# EAGLE design KnobController (EAGLE 7.6.0)
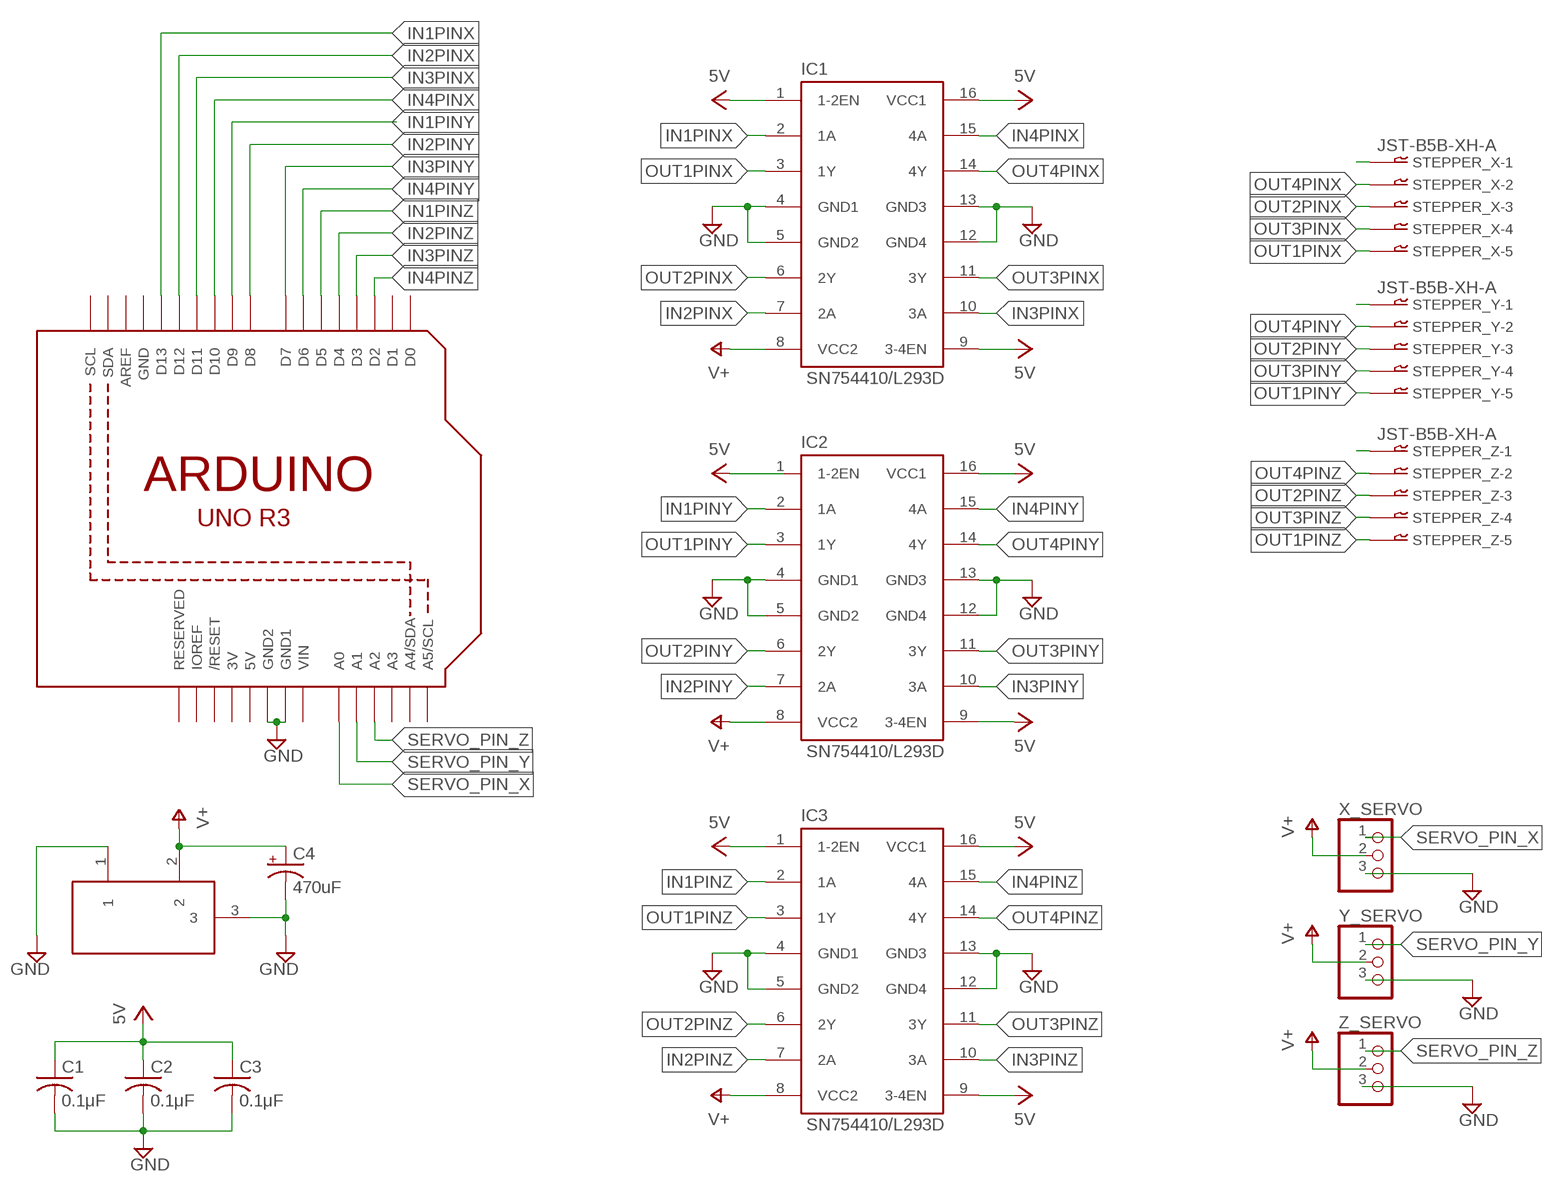
[diagram p0: schematic, sheet 1]

## Parts
C1  0.1μF  C-US025-025X050  [C025-025X050]
C2  0.1μF  C-US025-025X050  [C025-025X050]
C3  0.1μF  C-US025-025X050  [C025-025X050]
C4  470uF  CPOL-USE2.5-7  [E2,5-7]
IC1  SN754410/L293D  L293D  [DIL16]
IC2  SN754410/L293D  L293D  [DIL16]
IC3  SN754410/L293D  L293D  [DIL16]
PWR  MOTOR  DC21MMX  [DC-21MM]
STEPPER_X  JST-B5B-XH-A  05-JST-B5B-XH-A  [B5B-XH]
STEPPER_Y  JST-B5B-XH-A  05-JST-B5B-XH-A  [B5B-XH]
STEPPER_Z  JST-B5B-XH-A  05-JST-B5B-XH-A  [B5B-XH]
U1  ARDUINOR3-BPLACE  [ARDUINOR3-BPLACE]
X_SERVO  PINHD-1X3  [1X03]
Y_SERVO  PINHD-1X3  [1X03]
Z_SERVO  PINHD-1X3  [1X03]

## Nets
5V [5V]: C1.1 C2.1 C3.1 IC1.1(1-2EN) IC1.9(3-4EN) IC1.16(VCC1) IC2.1(1-2EN) IC2.9(3-4EN) IC2.16(VCC1) IC3.1(1-2EN) IC3.9(3-4EN) IC3.16(VCC1)
GND: C1.2 C2.2 C3.2 C4.- IC1.4(GND1) IC1.5(GND2) IC1.12(GND4) IC1.13(GND3) IC2.4(GND1) IC2.5(GND2) IC2.12(GND4) IC2.13(GND3) IC3.4(GND1) IC3.5(GND2) IC3.12(GND4) IC3.13(GND3) PWR.1 PWR.3 U1.GND1 U1.GND2 X_SERVO.3 Y_SERVO.3 Z_SERVO.3
IN1PINX: IC1.2(1A) U1.D13
IN1PINY: IC2.2(1A) U1.D9
IN1PINZ: IC3.2(1A) U1.D5
IN2PINX: IC1.7(2A) U1.D12
IN2PINY: IC2.7(2A) U1.D8
IN2PINZ: IC3.7(2A) U1.D4
IN3PINX: IC1.10(3A) U1.D11
IN3PINY: IC2.10(3A) U1.D7
IN3PINZ: IC3.10(3A) U1.D3
IN4PINX: IC1.15(4A) U1.D10
IN4PINY: IC2.15(4A) U1.D6
IN4PINZ: IC3.15(4A) U1.D2
N$8: STEPPER_Y.P$1
N$13: STEPPER_Z.P$1
NULL: STEPPER_X.P$1
OUT1PINX: IC1.3(1Y) STEPPER_X.P$5
OUT1PINY: IC2.3(1Y) STEPPER_Y.P$5
OUT1PINZ: IC3.3(1Y) STEPPER_Z.P$5
OUT2PINX: IC1.6(2Y) STEPPER_X.P$3
OUT2PINY: IC2.6(2Y) STEPPER_Y.P$3
OUT2PINZ: IC3.6(2Y) STEPPER_Z.P$3
OUT3PINX: IC1.11(3Y) STEPPER_X.P$4
OUT3PINY: IC2.11(3Y) STEPPER_Y.P$4
OUT3PINZ: IC3.11(3Y) STEPPER_Z.P$4
OUT4PINX: IC1.14(4Y) STEPPER_X.P$2
OUT4PINY: IC2.14(4Y) STEPPER_Y.P$2
OUT4PINZ: IC3.14(4Y) STEPPER_Z.P$2
SERVO_PIN_X: U1.A0 X_SERVO.1
SERVO_PIN_Y: U1.A1 Y_SERVO.1
SERVO_PIN_Z: U1.A2 Z_SERVO.1
VCC [VCC]: C4.+ IC1.8(VCC2) IC2.8(VCC2) IC3.8(VCC2) PWR.2 X_SERVO.2 Y_SERVO.2 Z_SERVO.2 ; supply symbol labelled V+
Unconnected: U1.A3 U1.A4(A4/SDA) U1.A5(A5/SCL) U1.AREF U1.D0 U1.D1 U1.IOREF U1.RESERVED U1.RESET(/RESET) U1.SCL U1.SDA

## Power pins joined to a net without a drawn wire
3V: U1.3V
5V: U1.5V
GND: U1.GND
VIN: U1.VIN

## Library data of the parts
C1-C3 = resistor:C-US: CAPACITOR, American symbol
C4 = rcl:CPOL-US: POLARIZED CAPACITOR, American symbol
IC1-IC3 = st-microelectronics:L293D: PUSH-PULL 4 CHANNEL DRIVER; MPN: L293D; OC_FARNELL: 9589619; OC_NEWARK: 56P8249
PWR = powersupply:DC21MM
STEPPER_X STEPPER_Y STEPPER_Z = bt_con-jst-xh:05-JST: JST CONNECTOR
U1 = adafruit:ARDUINOR3: This is a new object for the new Arduino R3 - with extra pins that you may want to use (such as IOref, and duplicated A4/A5
X_SERVO Y_SERVO Z_SERVO = pinhead:PINHD-1X3: PIN HEADER

## Net classes
0 default: width 0.406 mm, clearance 0.305 mm
1 5V: width 0.508 mm, clearance 0.305 mm
2 VCC: width 1.27 mm, clearance 0.305 mm

## Board
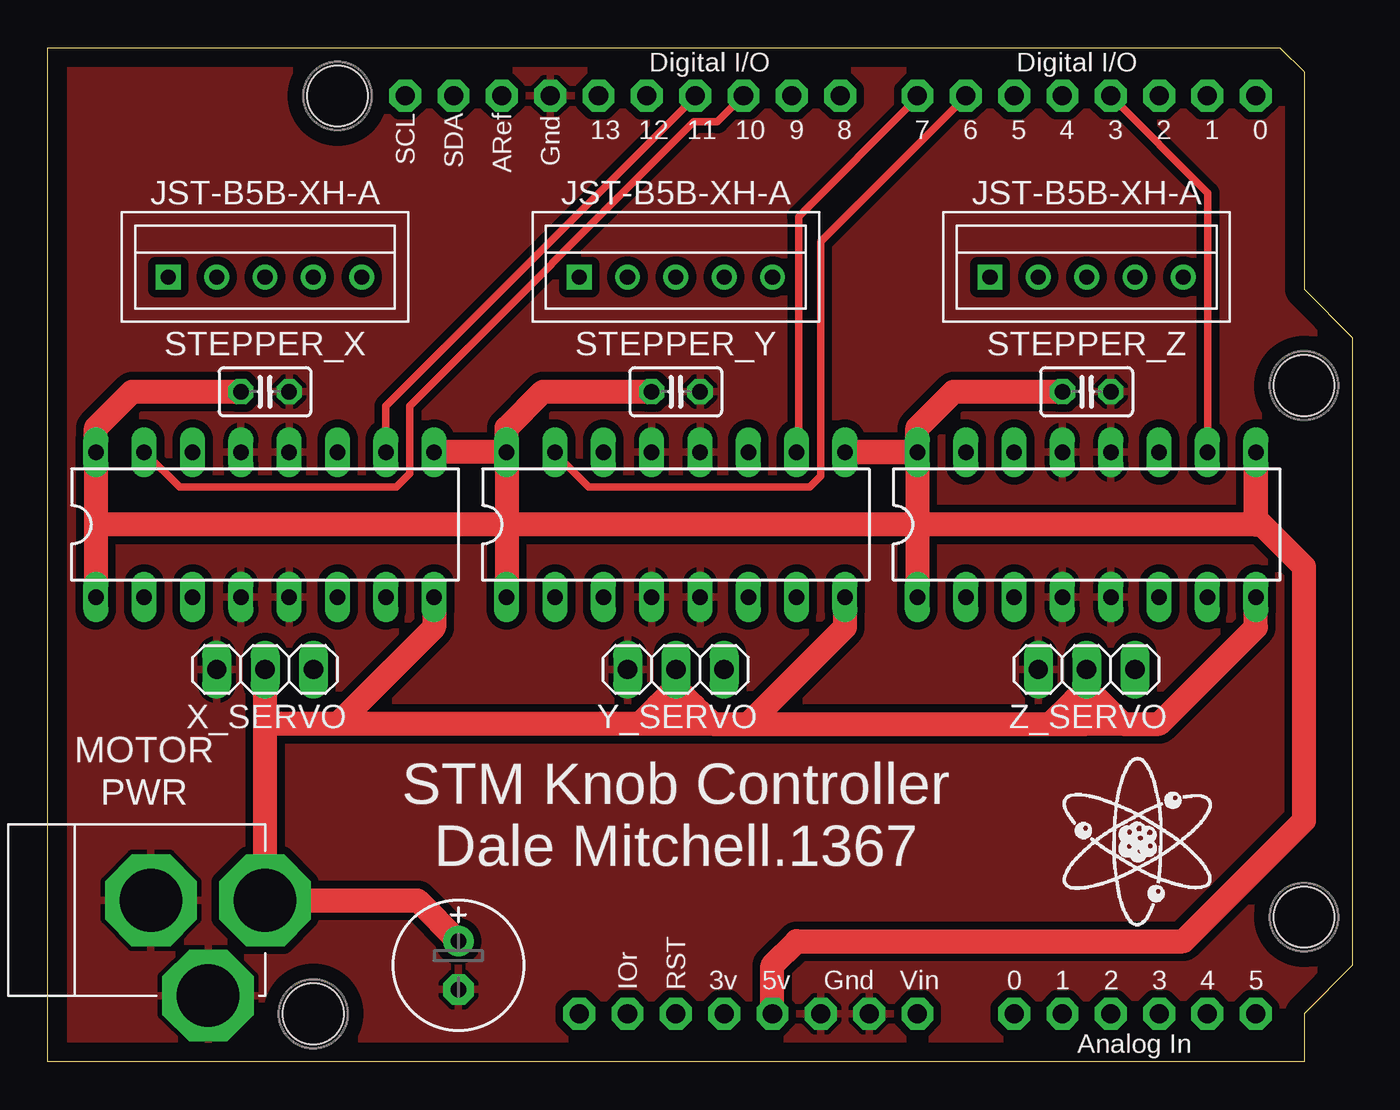
[diagram p1: board, top side]
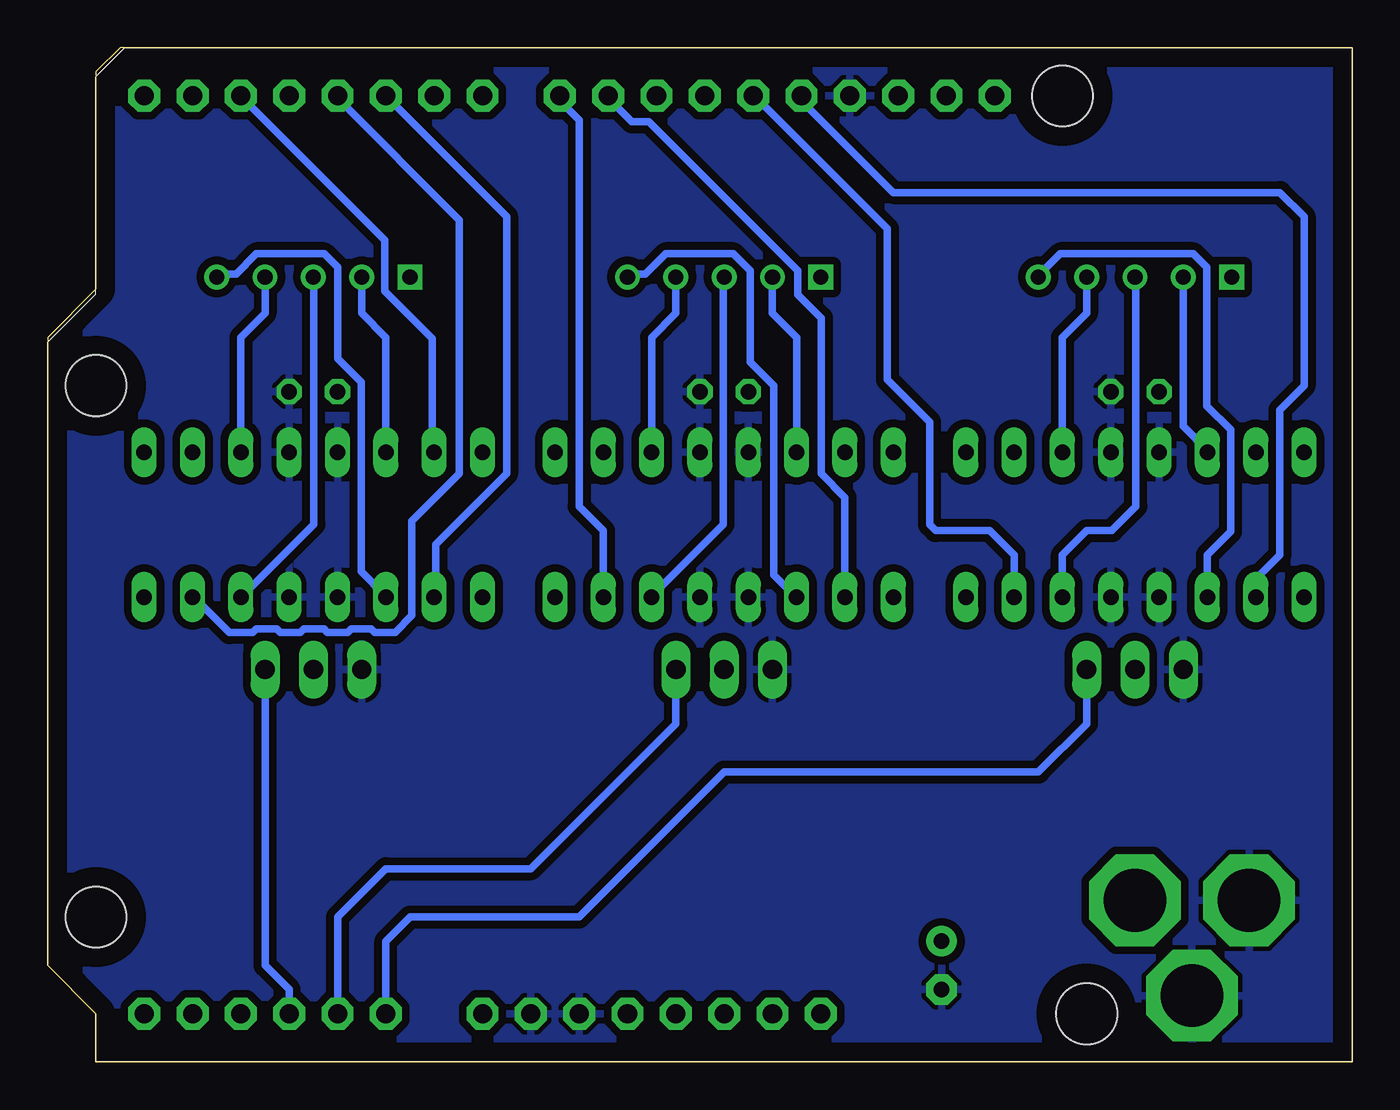
[diagram p2: board, bottom side, seen from below]

Size 68.58 x 53.34 mm. Coordinates in mm from the lower left corner, seen from the top.
Outline: 0,0 0,53.34 64.77,53.34 66.04,52.07 66.04,40.64 68.58,38.1 68.58,5.08 66.04,2.54 66.04,0 0,0
Copper layers (1*16): Top 0.035mm / dielectric 1.5mm / Bottom 0.035mm
Design rules "default *": minimum track width 10mil, minimum drill 24mil, track to track 16mil, track to pad 12mil, pad to pad 9mil, via to via 8mil, smd to smd 8mil, copper to edge 40mil, drill to drill 8mil, minimum pad ring 10mil, minimum via ring 8mil, stop-mask expansion 4mil, vias tented up to drill 0mil, thermal gap 10mil
Holes 3.2 mm at 13.97,2.54 15.24,50.8 66.04,35.56 66.04,7.62

### Footprints (pad centres in the part's own frame; a part is rotated, then mirrored left to right if it is on the bottom)
C025-025X050 = drill 0.813 octagon: 1 -1.27,0; 2 1.27,0
E2,5-7 = drill 0.813 pad 1.6: + -1.27,0 | drill 0.813 pad 1.6 octagon: - 1.27,0
DIL16 = drill 0.813 long: 1 -8.89,-3.81; 2 -6.35,-3.81; 3 -3.81,-3.81; 4 -1.27,-3.81; 5 1.27,-3.81; 6 3.81,-3.81; 7 6.35,-3.81; 8 8.89,-3.81; 9 8.89,3.81; 10 6.35,3.81; 11 3.81,3.81; 12 1.27,3.81; 13 -1.27,3.81; 14 -3.81,3.81; 15 -6.35,3.81; 16 -8.89,3.81
DC-21MM = drill 3.302 pad 4.826 octagon: 1 -5.08,-3.353; 2 -0.076,-6.35; 3 -0.076,-0.356
B5B-XH = drill 0.8 square: P$1 -5.08,0 | drill 0.8: P$2 -2.54,0; P$3 0,0; P$4 2.54,0; P$5 5.08,0
ARDUINOR3-BPLACE = drill 1 pad 1.676 octagon: 3V 35.56,2.54; 5V 38.1,2.54; A0 50.8,2.54; A1 53.34,2.54; A2 55.88,2.54; A3 58.42,2.54; A4 60.96,2.54; A5 63.5,2.54; AREF 23.876,50.8; D0 63.5,50.8; D1 60.96,50.8; D2 58.42,50.8; D3 55.88,50.8; D4 53.34,50.8; D5 50.8,50.8; D6 48.26,50.8; D7 45.72,50.8; D8 41.656,50.8; D9 39.116,50.8; D10 36.576,50.8; D11 34.036,50.8; D12 31.496,50.8; D13 28.956,50.8; GND 26.416,50.8; GND1 43.18,2.54; GND2 40.64,2.54; IOREF 30.48,2.54; RESERVED 27.94,2.54; RESET 33.02,2.54; SCL 18.796,50.8; SDA 21.336,50.8; VIN 45.72,2.54
1X03 = drill 1.016 long: 1 -2.54,0; 2 0,0; 3 2.54,0

### Placement (x,y rotation side)
C1  11.43,35.24 0 top
C2  33.02,35.24 0 top
C3  54.61,35.24 0 top
C4  21.59,5.08 270 top
IC1  11.43,28.26 0 top
IC2  33.02,28.26 0 top
IC3  54.61,28.26 0 top
PWR  5.08,8.57 90 top
STEPPER_X  11.43,41.27 0 top
STEPPER_Y  33.02,41.27 0 top
STEPPER_Z  54.61,41.27 0 top
U1  0,0 0 top
U$1  [ATOM]  57.47,11.43 0 top
X_SERVO  11.43,20.64 180 top
Y_SERVO  33.02,20.64 180 top
Z_SERVO  54.61,20.64 180 top

### Tracks (layer width: path | path; a pad name or v marks a point on that pad's centre or on a via)
5V
  Top 0.508: 24.13,28.27 24.18,28.27 24.18,28.26
  Top 1.27: 2.54,27.94 IC1.16 2.54,33.34 4.45,35.24 C1.1 | 2.54,27.94 IC1.1 | IC2.16 24.13,28.27 IC2.1 | IC3.16 45.72,31.75 | 45.72,28.26 IC3.1 | IC2.16 IC1.9 | IC2.16 24.13,33.34 26.04,35.24 C2.1 | IC3.16 45.72,33.34 47.62,35.24 C3.1 | U1.5V 38.1,5.08 39.37,6.35 59.69,6.35 66.04,12.7 66.04,26.04 63.5,28.57 IC3.9 63.5,28.26 45.72,28.26 | 45.72,28.26 24.18,28.26 2.86,28.26 2.54,27.94 | IC3.16 IC2.9 45.4,32.07 45.72,31.75 | 45.72,31.75 45.72,28.26
GND
  pour Bottom (isolate 0.406): 0,0 0,53.34 64.77,53.34 66.04,52.07 66.04,40.64 68.58,38.1 68.58,5.08 66.04,2.54 66.04,0
  pour Top (isolate 0.406): 0,0 0,53.34 64.77,53.34 66.04,52.07 66.04,40.64 68.58,38.1 68.58,5.08 66.04,2.54 66.04,0
IN1PINX
  Bottom 0.406: U1.D13 28.96,50.55 24.13,45.72 3.81,45.72 2.54,44.45 2.54,35.56 3.81,34.29 3.81,26.67 5.08,25.4 IC1.2
IN1PINY
  Bottom 0.406: IC2.2 26.67,29.69 27.91,30.94 27.91,39.12 29.16,40.36 29.16,41.6 36.98,49.43 37.87,49.43 39.12,50.67 U1.D9
IN1PINZ
  Bottom 0.406: U1.D5 44.45,44.45 44.45,30.94 48.18,27.2 48.18,24.54 IC3.2
IN2PINX
  Bottom 0.406: U1.D12 31.43,50.8 24.45,43.81 24.45,35.88 22.23,33.66 22.23,28.26 21.91,27.94 19.05,27.94 17.78,26.67 IC1.7
IN2PINY
  Bottom 0.406: U1.D8 41.66,50.55 40.64,49.53 40.64,29.21 39.37,27.94 IC2.7
IN2PINZ
  Bottom 0.406: IC3.7 60.81,24.36 59.03,22.58 57.78,22.58 57.61,22.76 56.54,22.76 56.36,22.58 55.3,22.58 55.12,22.76 54.05,22.76 53.87,22.58 52.81,22.58 52.63,22.76 51.56,22.76 51.38,22.58 50.32,22.58 49.43,23.47 49.43,28.45 46.94,30.94 46.94,44.27 53.34,50.67 U1.D4
IN3PINX
  Top 0.406: IC1.10 17.78,34.49 33.96,50.67 U1.D11
IN3PINY
  Top 0.406: IC2.10 39.47,32.18 39.47,44.45 45.7,50.67 U1.D7
IN3PINZ
  Top 0.406: U1.D3 60.98,45.7 60.98,32.18 IC3.10
IN4PINX
  Top 0.406: U1.D10 35.2,49.43 33.96,49.43 19.02,34.49 19.02,30.94 18.31,30.23 6.93,30.23 5.16,32 IC1.15
IN4PINY
  Top 0.406: IC2.15 26.67,32 28.45,30.23 40.07,30.23 40.64,30.8 40.64,43.13 48.18,50.67 U1.D6
IN4PINZ
  Bottom 0.406: IC3.15 48.36,32.18 48.36,38.05 50.85,40.54 50.85,43.2 58.32,50.67 U1.D2
OUT1PINX
  Bottom 0.406: STEPPER_X.P$5 16.36,41.43 16.42,41.43 15.35,42.49 8.36,42.49 7.64,41.78 7.64,34.49 6.4,33.25 6.4,27.89 7.62,26.67 IC1.3
OUT1PINY
  Bottom 0.406: STEPPER_Y.P$5 38.05,41.43 37.16,41.43 36.09,42.49 32.54,42.49 31.65,41.6 31.65,36.8 30.4,35.56 30.4,25.6 29.34,24.54 IC2.3
OUT1PINZ
  Bottom 0.406: STEPPER_Z.P$5 59.56,41.43 58.67,41.43 57.61,42.49 54.05,42.49 53.34,41.78 53.34,36.98 52.09,35.74 52.09,25.78 50.85,24.54 IC3.3
OUT2PINX
  Bottom 0.406: STEPPER_X.P$3 11.38,41.25 11.38,29.21 12.65,27.94 13.97,27.94 15.24,26.67 IC1.6
OUT2PINY
  Bottom 0.406: STEPPER_Y.P$3 33.07,41.25 33.07,28.27 36.8,24.54 IC2.6
OUT2PINZ
  Bottom 0.406: STEPPER_Z.P$3 54.59,41.25 54.59,28.27 58.32,24.54 IC3.6
OUT3PINX
  Bottom 0.406: STEPPER_X.P$4 13.97,39.37 15.24,38.1 IC1.11
OUT3PINY
  Bottom 0.406: STEPPER_Y.P$4 35.56,39.37 36.83,38.1 IC2.11
OUT3PINZ
  Bottom 0.406: STEPPER_Z.P$4 57.15,39.37 58.42,38.1 IC3.11
OUT4PINX
  Bottom 0.406: STEPPER_X.P$2 8.89,33.43 7.64,32.18 IC1.14
OUT4PINY
  Bottom 0.406: STEPPER_Y.P$2 30.48,39.37 29.21,38.1 IC2.14
OUT4PINZ
  Bottom 0.406: IC3.14 50.8,38.1 52.07,39.37 STEPPER_Z.P$2
SERVO_PIN_X
  Bottom 0.406: U1.A0 50.8,6.35 49.53,7.62 40.64,7.62 33.02,15.24 16.51,15.24 13.97,17.78 X_SERVO.1
SERVO_PIN_Y
  Bottom 0.406: U1.A1 53.34,7.62 50.8,10.16 43.18,10.16 35.56,17.78 Y_SERVO.1
SERVO_PIN_Z
  Top 1.27: Z_SERVO.1 57.15,20.32
  Bottom 0.406: U1.A2 55.88,3.81 57.15,5.08 Z_SERVO.1
VCC
  Top 1.27: C4.+ 19.44,8.5 PWR.2 11.43,17.78 | 11.43,17.78 X_SERVO.2 | 31.11,17.78 15.24,17.78 | 15.24,17.78 11.43,17.78 | IC1.8 20.32,22.86 15.24,17.78 | IC2.8 41.91,22.86 36.83,17.78 | 36.83,17.78 52.7,17.78 | 52.7,17.78 54.61,17.78 | 56.52,17.78 58.42,17.78 63.5,22.86 IC3.8 | 54.61,19.68 Z_SERVO.2 54.61,17.78 | 34.29,18.41 34.29,17.78 | 34.92,17.78 36.83,17.78 | 52.7,17.78 53.98,19.05 55.24,19.05 56.52,17.78 | 56.52,17.78 54.61,17.78 | 34.29,17.78 33.02,17.78 | 33.02,17.78 31.11,17.78 | 31.11,17.78 32.07,18.73 | 32.07,18.73 33.97,18.73 | 33.97,18.73 34.29,18.41 | 34.29,18.41 34.92,17.78 | 33.02,19.68 32.07,18.73 | 33.02,19.68 33.97,18.73 | 34.92,17.78 34.29,17.78 | 33.02,19.68 33.02,17.78 | Y_SERVO.2 33.02,19.68

### Text on the board
tNames: STM Knob Controller / Dale Mitchell.1367